# Altium schematic sheet serial.SchDoc
size A3
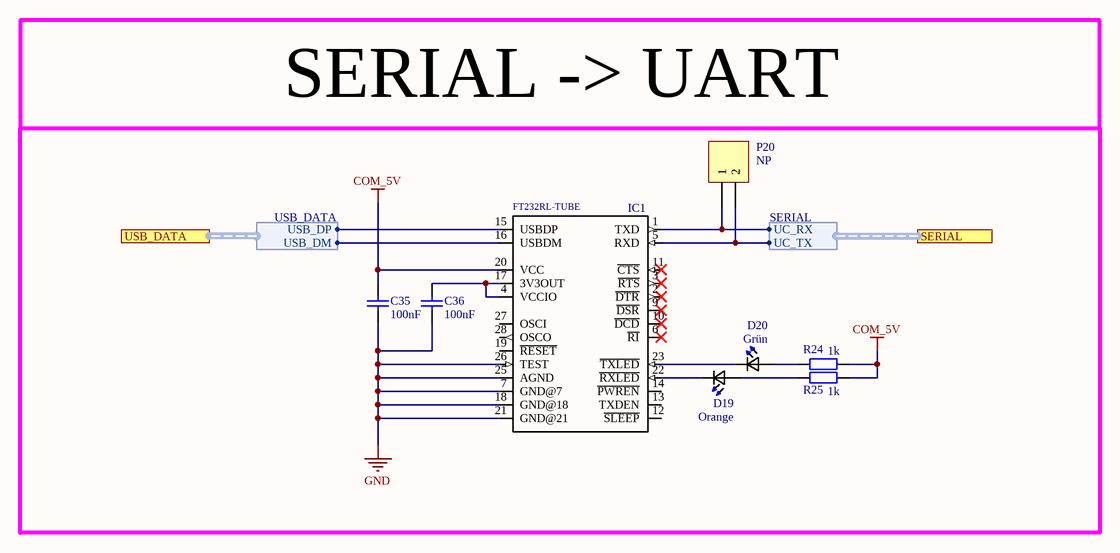
[diagram p0: serial.SchDoc]

## Parts
C35  100nF  [CAP_0402i_1005m -N]
C36  100nF  [CAP_0402i_1005m -N]
D19  Orange  [*0603]
D20  Grün  [*0603]
IC1  FT232RL-TUBE  [*SSOP28-LD]  (value not drawn)
P20  NP  [HDR1X2]
R24  1k  [RES_0603i_1608m -N]
R25  1k  [RES_0603i_1608m -N]

## Blocks framed on the sheet
SERIAL -> UART: C35 C36 D19 D20 IC1 P20 R24 R25

## Ports
SERIAL (harness SERIAL), USB_DATA (harness USB_DATA)

## Harnesses
SERIAL: UC_RX, UC_TX
USB_DATA: USB_DP, USB_DM

## Nets
COM_5V: C35.2 IC1.20(VCC) R24.2 R25.2
GND: C35.1 C36.1 IC1.7(GND@7) IC1.18(GND@18) IC1.21(GND@21) IC1.25(AGND) IC1.26(TEST)
NetC36_2: C36.2 IC1.4(VCCIO) IC1.17(3V3OUT)
NetD19_1: D19.1(K2) IC1.22(~{RXLED})
NetD19_2: D19.2(A2) R25.1
NetD20_1: D20.1(K2) IC1.23(~{TXLED})
NetD20_2: D20.2(A2) R24.1
NetIC1_1: IC1.1(TXD) P20.1 ; port SERIAL.UC_RX
NetIC1_5: IC1.5(RXD) P20.2 ; port SERIAL.UC_TX
NetIC1_15: IC1.15(USBDP) ; port USB_DATA.USB_DP
NetIC1_16: IC1.16(USBDM) ; port USB_DATA.USB_DM

Not connected (* = marked no-connect by the designer): IC1 2(~{DTR})* 3(~{RTS})* 6(~{RI})* 9(~{DSR})* 10(~{DCD})* 11(~{CTS})* 12(~{SLEEP}) 13(TXDEN) 14(~{PWREN}) 19(~{RESET}) 27(OSCI) 28(OSCO)

## Notes on the sheet
- 1
- 2
- 3
- 4
- 5
- 6
- 7
- 8
- A
- B
- C
- D
- Project:
- Date:
- Drawing number:
- Rev:
- Format:
- A3
- Drawn by:
- Laboratory:
- Page
- Sheet:
- of
- File:

## Library data of the parts
C35 C36 = Cap: capacitor
D19 = LTST-C191KFKT: / LED; SMD; 0603; orange; 45-90mcd; 1.6x0.8x0.55mm; 130Â°; 2Ã·2.4V; 20mA /; MF: Lite-On Inc.; Digi-Key_Purchase_URL: https://www.digikey.com/product-detail/en/lite-on-inc/LTST-C191KFKT/160-1445-1-ND/386832?utm_source=snapeda&utm_medium=aggregator&utm_campaign=symbol; SnapEDA_Link: https://www.snapeda.com/parts/LTST-C191KFKT/Lite-On%20Inc./view-part/?ref=snap; MP: LTST-C191KFKT; Digi-Key_Part_Number: 160-1445-1-ND; Package: 0603 Lite-On; Value: *
D20 = LTST-C191KGKT: / LED; SMD; 0603; grün; 35mcd; 1.6x0.8x0.55mm; 130Â°; 2Ã·2.V; 20mA /; MF: Lite-On Inc.; Digi-Key_Purchase_URL: https://www.digikey.ch/product-detail/de/lite-on-inc/LTST-C191KGKT/160-1446-1-ND/386834; SnapEDA_Link: https://www.snapeda.com/parts/LTST-C191KFKT/Lite-On%20Inc./view-part/?ref=snap; MP: LTST-C191KGKT; Digi-Key_Part_Number: 160-1446-1-ND; Package: 0603 Lite-On; Value: *
IC1 = FT232RL-TUBE: USB-to-UART 1-CH 256byte FIFO 5V 28-Pin SSOP Tube; MF: FTDI,; Digi-Key_Part_Number: 768-1306-ND; Package: SSOP-28 FTDI; Digi-Key_Purchase_URL: https://www.digikey.com/product-detail/en/ftdi-future-technology-devices-international-ltd/FT232RL-TUBE/768-1306-ND/4006920?utm_source=snapeda&utm_medium=aggregator&utm_campaign=symbol; SnapEDA_Link: https://www.snapeda.com/parts/FT232RL-TUBE/FTDI%2C%20Future%20Technology%20Devices%20International%20Ltd/view-part/?ref=snap; MP: FT232RL-TUBE; Value: *
P20 = Header 2: Header, 2-Pin
R24 R25 = Res: Resistor